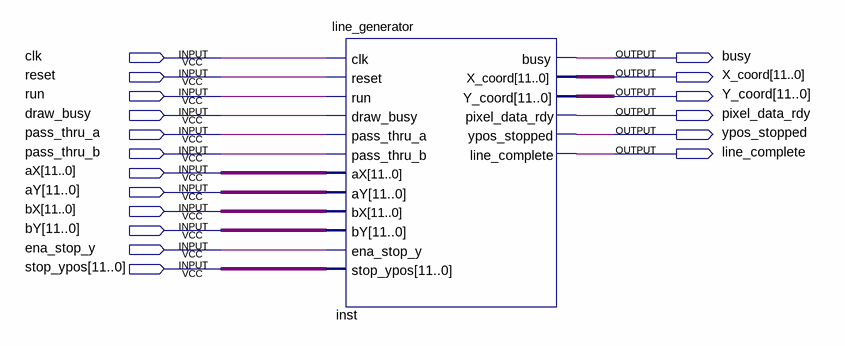
[diagram p0: schematic sheet]
// Quartus schematic line_gen.bdf as structural Verilog: 1 symbols, 18 pins
module line_gen (
  input  clk,
  input  reset,
  input  run,
  input  draw_busy,
  input  pass_thru_a,
  input  pass_thru_b,
  input  [11:0] aX,
  input  [11:0] aY,
  input  [11:0] bX,
  input  [11:0] bY,
  input  ena_stop_y,
  input  [11:0] stop_ypos,
  output busy,
  output [11:0] X_coord,
  output [11:0] Y_coord,
  output pixel_data_rdy,
  output ypos_stopped,
  output line_complete
);

  line_generator inst (
    .clk(clk), .reset(reset), .run(run), .draw_busy(draw_busy), .pass_thru_a(pass_thru_a),
    .pass_thru_b(pass_thru_b), .aX(aX), .aY(aY), .bX(bX), .bY(bY), .ena_stop_y(ena_stop_y),
    .stop_ypos(stop_ypos), .busy(busy), .X_coord(X_coord), .Y_coord(Y_coord),
    .pixel_data_rdy(pixel_data_rdy), .ypos_stopped(ypos_stopped), .line_complete(line_complete));
endmodule
